# Altium schematic sheet I2C_switch.SchDoc: =DocumentName
size A4; SPICEModelCacheVGBTAUBO: <root> / <DocumentId>VGBTAUBO</DocumentId> / </root>; DocumentNumber: 1; Revision: 0; SheetNumber: 1; SheetTotal: 18; Last modified by: Maciej Przybysz
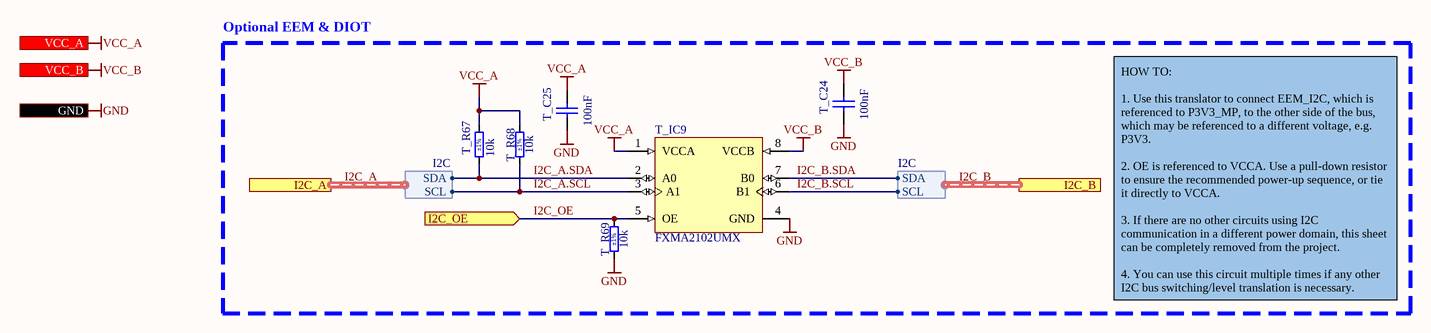
[diagram p0: I2C_switch.SchDoc]

## Parts
T_C24  100nF  [CAPC1005X55N]
T_C25  100nF  [CAPC1005X55N]
T_IC9  FXMA2102UMX  [FXMA2102UMX]
T_R67  10k  Tolerance: ±1%  [RESC1005X40N]
T_R68  10k  Tolerance: ±1%  [RESC1005X40N]
T_R69  10k  Tolerance: ±1%  [RESC1005X40N]

## Blocks framed on the sheet
Optional EEM & DIOT: T_C24 T_C25 T_IC9 T_R67-T_R69

## Ports
GND, I2C_A (harness I2C), I2C_B (harness I2C), I2C_OE (in), VCC_A (in), VCC_B (in)

## Harnesses
I2C: SDA, SCL

## Nets
GND: T_C24.1 T_C25.1 T_IC9.4(GND) T_R69.1 ; port GND
VCC_A: T_C25.2 T_IC9.1(VCCA) T_R67.2 T_R68.2 ; port VCC_A
VCC_B: T_C24.2 T_IC9.8(VCCB) ; port VCC_B
I2C_A.SCL: T_IC9.3(A1) T_R68.1 ; port I2C_A.SCL
I2C_A.SDA: T_IC9.2(A0) T_R67.1 ; port I2C_A.SDA
I2C_B.SCL: T_IC9.6(B1) ; port I2C_B.SCL
I2C_B.SDA: T_IC9.7(B0) ; port I2C_B.SDA
I2C_OE: T_IC9.5(OE) T_R69.2 ; port I2C_OE

## Buses and harness runs
harness I2C_A = port I2C_A
harness I2C_B = port I2C_B

## Notes on the sheet
- HOW TO:
  1. Use this translator to connect EEM_I2C, which is referenced to P3V3_MP, to the other side of the bus, which may be referenced to a different voltage, e.g. P3V3.
  2. OE is referenced to VCCA. Use a pull-down resistor to ensure the recommended power-up sequence, or tie it directly to VCCA.
  3. If there are no other circuits using I2C communication in a different power domain, this sheet can be completely removed from the project.
  4. You can use this circuit multiple times if any other I2C bus switching/level translation is necessary.
- Filename:
- Project:
- SINARA
  LOGO
  TBD
- Originally released by:
- Last modified by:
- Last reviewed by:
- Size:
- Version:
- Last mod. date :
- Sheet:
- A4
- Copyright =CopyrightOwner
  This source describes Open Hardware and is licensed under the CERN-OHL-W v1. You may redistribute and modify this documentation and make products using it under the terms of the CERN-OHL-W v1 (https:/cern.ch/cern-ohl). This documentation is distributed WITHOUT ANY EXPRESS OR IMPLIED WARRANTY, INCLUDING OF MERCHANTABILITY, SATISFACTORY QUALITY AND FITNESS FOR A PARTICULAR PURPOSE. Please see the CERN-OHL-W v1 for applicable conditions.
  As per CERN-OHL-W 1 section 4.1, should You produce hardware based on these sources, You must maintain the Source Location visible on the external case of the product you make using this documentation.
  Source location: =Github
- Sinara Opern Hardware:
- https://github.com/sinara-hw

## Library data of the parts
T_C24 T_C25 = CC0402_100NF_16V_10%_X5R: Non-polarised capacitor; Part Description: SMD Multilayer Chip Ceramic Capacitor; Manufacturer: GENERIC; Manufacturer1 Part Number: GRM155R61C104KA88D; Voltage: 16V; TC: X5R; Tolerance: ±10%; Table: Capacitors SMD; Part Number: CC0402_100NF_16V_10%_X5R; Component Kind: Standard; Component Type: Standard; Pin Count: 2; Value: 100nF; Status: None; Manufacturer Part Number: CC0402_100NF_16V_10%_X5R; Case: 0402; Mounted: Yes; Socket: No; SMD: Yes; Manufacturer1 Example: MURATA; Manufacturer1 ComponentHeight: 0.55mm; HelpURL: \\cern.ch\dfs\Applications\Altium\Datasheets\CC0402_X5R_MURATA_GRM.pdf; Author: CERN DEM JLC; CreateDate: 2013-12-10; LatestRevisionDate: 2013-12-10
T_IC9 = CMP-015-00014-1: Dual Supply 2-Bit Voltage Translator/Buffer/Repeater Isolator for I2C Applications; Manufacturer: Onsemi; Max Supply Voltage: 5.5V; Min Supply Voltage: 1.65V; Min Operating Temperature: -40°C; Pins: 8; Max Operating Temperature: 85°C; Manufacaturer Part Number: FXMA2102UMX; Mounting Technology: Surface Mount
T_R67-T_R69 = R0402_10K_1%_0.0625W_100PPM: Resistor - 1%; Part Description: General Purpose Thick Film Chip Resistor; Manufacturer: GENERIC; Manufacturer1 Part Number: 232270671003L; TC: ±100ppm/°C; PressFit: No; Part Number: R0402_10K_1%_0.0625W_100PPM; Component Kind: Standard; Component Type: Standard; Pin Count: 2; Value: 10k; Status: Not Recommended; Power: 0.0625W; Manufacturer Part Number: R0402_10K_1%_0.0625W_100PPM; Case: 0402; Mounted: Yes; Sense: No; Socket: No; SMD: Yes; Manufacturer1 Example: YAGEO PHYCOMP; Manufacturer1 ComponentHeight: 0.4mm; HelpURL: \\cern.ch\dfs\Applications\Altium\Datasheets\R0402_Phycomp_RC0402.pdf; Author: CERN DEM JLC; CreateDate: 03.12.2007; LatestRevisionDate: 17.10.2012